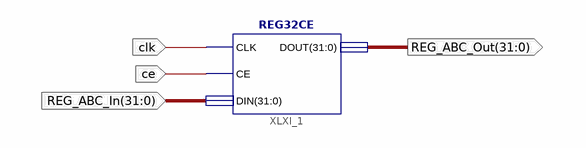
[diagram p0: schematic sheet 1]
// Xilinx ISE schematic REG_A_B_C.sch (spartan6) as structural Verilog: 1 symbols, 4 ports
module REG_A_B_C (
  input  clk,
  input  ce,
  input  [31:0] REG_ABC_In,
  output [31:0] REG_ABC_Out
);

  REG32CE XLXI_1 (.CLK(clk), .CE(ce), .DIN(REG_ABC_In), .DOUT(REG_ABC_Out));
endmodule
